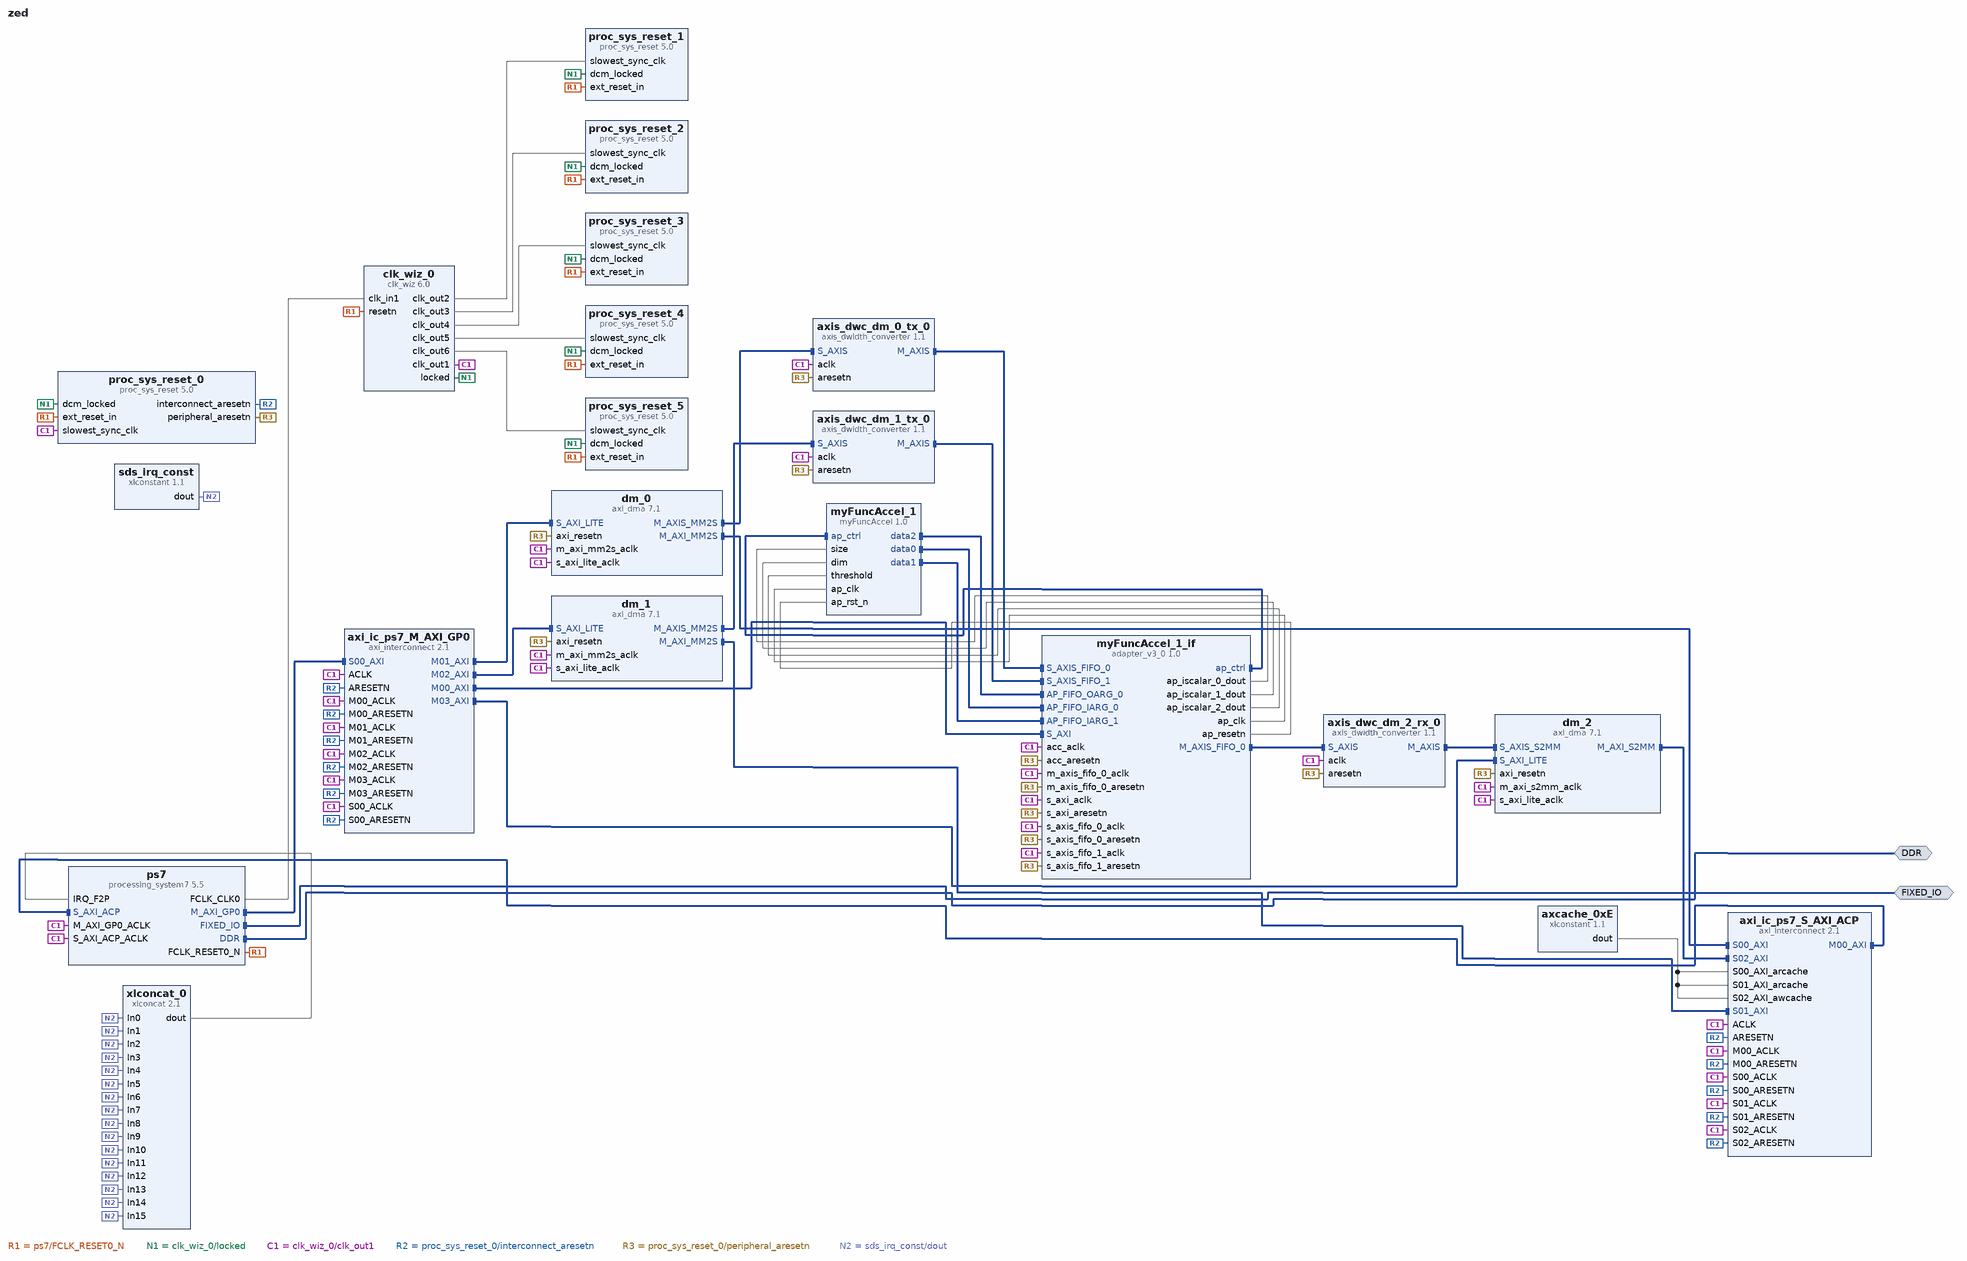
[diagram p0: block diagram of the top level]
# Vivado block design zed, xc7z020clg484-1, Vivado 2018.3
create_bd_design zed

create_bd_intf_port -mode Master -vlnv xilinx.com:interface:ddrx_rtl:1.0 DDR
create_bd_intf_port -mode Master -vlnv xilinx.com:display_processing_system7:fixedio_rtl:1.0 FIXED_IO

create_bd_cell -type ip -vlnv xilinx.com:ip:processing_system7:5.5 ps7
set_property -dict [list \
  CONFIG.PCW_APU_PERIPHERAL_FREQMHZ 666.666667 \
  CONFIG.PCW_ENET0_ENET0_IO {MIO 16 .. 27} \
  CONFIG.PCW_ENET0_GRP_MDIO_ENABLE 1 \
  CONFIG.PCW_ENET0_GRP_MDIO_IO {MIO 52 .. 53} \
  CONFIG.PCW_ENET0_PERIPHERAL_ENABLE 1 \
  CONFIG.PCW_ENET0_RESET_ENABLE 0 \
  CONFIG.PCW_ENET_RESET_ENABLE 1 \
  CONFIG.PCW_ENET_RESET_SELECT {Share reset pin} \
  CONFIG.PCW_FPGA0_PERIPHERAL_FREQMHZ 100.000000 \
  CONFIG.PCW_FPGA1_PERIPHERAL_FREQMHZ 150.000000 \
  CONFIG.PCW_GPIO_MIO_GPIO_ENABLE 1 \
  CONFIG.PCW_GPIO_MIO_GPIO_IO MIO \
  CONFIG.PCW_I2C_RESET_ENABLE 1 \
  CONFIG.PCW_IRQ_F2P_INTR 1 \
  CONFIG.PCW_PRESET_BANK1_VOLTAGE {LVCMOS 1.8V} \
  CONFIG.PCW_QSPI_GRP_SINGLE_SS_ENABLE 1 \
  CONFIG.PCW_QSPI_GRP_SINGLE_SS_IO {MIO 1 .. 6} \
  CONFIG.PCW_QSPI_PERIPHERAL_ENABLE 1 \
  CONFIG.PCW_QSPI_QSPI_IO {MIO 1 .. 6} \
  CONFIG.PCW_SD0_GRP_CD_ENABLE 1 \
  CONFIG.PCW_SD0_GRP_CD_IO {MIO 47} \
  CONFIG.PCW_SD0_GRP_WP_ENABLE 1 \
  CONFIG.PCW_SD0_GRP_WP_IO {MIO 46} \
  CONFIG.PCW_SD0_PERIPHERAL_ENABLE 1 \
  CONFIG.PCW_SD0_SD0_IO {MIO 40 .. 45} \
  CONFIG.PCW_SDIO_PERIPHERAL_FREQMHZ 50 \
  CONFIG.PCW_SINGLE_QSPI_DATA_MODE x4 \
  CONFIG.PCW_TTC0_PERIPHERAL_ENABLE 1 \
  CONFIG.PCW_TTC0_TTC0_IO EMIO \
  CONFIG.PCW_UART1_PERIPHERAL_ENABLE 1 \
  CONFIG.PCW_UART1_UART1_IO {MIO 48 .. 49} \
  CONFIG.PCW_UART_PERIPHERAL_FREQMHZ 50 \
  CONFIG.PCW_UIPARAM_DDR_FREQ_MHZ 533.333313 \
  CONFIG.PCW_UIPARAM_DDR_PARTNO {MT41J128M16 HA-15E} \
  CONFIG.PCW_USB0_PERIPHERAL_ENABLE 1 \
  CONFIG.PCW_USB0_RESET_ENABLE 0 \
  CONFIG.PCW_USB0_USB0_IO {MIO 28 .. 39} \
  CONFIG.PCW_USB_RESET_ENABLE 1 \
  CONFIG.PCW_USB_RESET_SELECT {Share reset pin} \
  CONFIG.PCW_USE_DEFAULT_ACP_USER_VAL 1 \
  CONFIG.PCW_USE_FABRIC_INTERRUPT 1 \
  CONFIG.PCW_USE_S_AXI_ACP 1 \
  CONFIG.preset ZedBoard \
] [get_bd_cells ps7]
# 224 more settings of ps7 are not shown: defaults, MIO pin electricals, DDR timing, and values the tool derives
create_bd_cell -type ip -vlnv xilinx.com:ip:xlconcat:2.1 xlconcat_0
set_property -dict {CONFIG.NUM_PORTS 16} [get_bd_cells xlconcat_0]
create_bd_cell -type ip -vlnv xilinx.com:ip:clk_wiz:6.0 clk_wiz_0
set_property -dict [list \
  CONFIG.CLKOUT1_REQUESTED_OUT_FREQ 100 \
  CONFIG.CLKOUT2_REQUESTED_OUT_FREQ 142 \
  CONFIG.CLKOUT2_USED true \
  CONFIG.CLKOUT3_REQUESTED_OUT_FREQ 166 \
  CONFIG.CLKOUT3_USED true \
  CONFIG.CLKOUT4_REQUESTED_OUT_FREQ 200 \
  CONFIG.CLKOUT4_USED true \
  CONFIG.CLKOUT5_REQUESTED_OUT_FREQ 50 \
  CONFIG.CLKOUT5_USED true \
  CONFIG.CLKOUT6_REQUESTED_OUT_FREQ 41.66 \
  CONFIG.CLKOUT6_USED true \
  CONFIG.RESET_TYPE ACTIVE_LOW \
] [get_bd_cells clk_wiz_0]
create_bd_cell -type ip -vlnv xilinx.com:ip:proc_sys_reset:5.0 proc_sys_reset_0
create_bd_cell -type ip -vlnv xilinx.com:ip:proc_sys_reset:5.0 proc_sys_reset_1
create_bd_cell -type ip -vlnv xilinx.com:ip:proc_sys_reset:5.0 proc_sys_reset_2
create_bd_cell -type ip -vlnv xilinx.com:ip:proc_sys_reset:5.0 proc_sys_reset_3
create_bd_cell -type ip -vlnv xilinx.com:ip:proc_sys_reset:5.0 proc_sys_reset_4
create_bd_cell -type ip -vlnv xilinx.com:ip:proc_sys_reset:5.0 proc_sys_reset_5
create_bd_cell -type ip -vlnv xilinx.com:ip:axi_dma:7.1 dm_0
set_property -dict [list \
  CONFIG.c_dlytmr_resolution 1250 \
  CONFIG.c_include_mm2s 1 \
  CONFIG.c_include_mm2s_dre 1 \
  CONFIG.c_include_mm2s_sf 1 \
  CONFIG.c_include_s2mm 0 \
  CONFIG.c_include_sg 0 \
  CONFIG.c_m_axi_mm2s_data_width 64 \
  CONFIG.c_m_axis_mm2s_tdata_width 64 \
  CONFIG.c_mm2s_burst_size 64 \
  CONFIG.c_sg_length_width 26 \
] [get_bd_cells dm_0]
create_bd_cell -type ip -vlnv xilinx.com:ip:axi_dma:7.1 dm_1
set_property -dict [list \
  CONFIG.c_dlytmr_resolution 1250 \
  CONFIG.c_include_mm2s 1 \
  CONFIG.c_include_mm2s_dre 1 \
  CONFIG.c_include_mm2s_sf 1 \
  CONFIG.c_include_s2mm 0 \
  CONFIG.c_include_sg 0 \
  CONFIG.c_m_axi_mm2s_data_width 64 \
  CONFIG.c_m_axis_mm2s_tdata_width 64 \
  CONFIG.c_mm2s_burst_size 64 \
  CONFIG.c_sg_length_width 26 \
] [get_bd_cells dm_1]
create_bd_cell -type ip -vlnv xilinx.com:ip:axi_dma:7.1 dm_2
set_property -dict [list \
  CONFIG.c_dlytmr_resolution 1250 \
  CONFIG.c_include_mm2s 0 \
  CONFIG.c_include_s2mm 1 \
  CONFIG.c_include_s2mm_dre 1 \
  CONFIG.c_include_s2mm_sf 1 \
  CONFIG.c_include_sg 0 \
  CONFIG.c_m_axi_s2mm_data_width 64 \
  CONFIG.c_s2mm_burst_size 64 \
  CONFIG.c_sg_length_width 26 \
] [get_bd_cells dm_2]
create_bd_cell -type ip -vlnv xilinx.com:hls:myFuncAccel:1.0 myFuncAccel_1
create_bd_cell -type ip -vlnv xilinx.com:ip:adapter_v3_0:1.0 myFuncAccel_1_if
set_property -dict [list \
  CONFIG.C_INPUT_SCALAR_0_WIDTH 32 \
  CONFIG.C_INPUT_SCALAR_1_WIDTH 32 \
  CONFIG.C_INPUT_SCALAR_2_WIDTH 32 \
  CONFIG.C_NUM_INPUT_FIFOs 2 \
  CONFIG.C_NUM_OUTPUT_FIFOs 1 \
  CONFIG.C_N_INPUT_SCALARS 3 \
  CONFIG.M_AXIS_FIFO_0_BYTE_WIDTH 32 \
  CONFIG.M_AXIS_FIFO_0_DEPTH 1024 \
  CONFIG.M_AXIS_FIFO_0_DMWIDTH 32 \
  CONFIG.M_AXIS_FIFO_0_WIDTH 32 \
  CONFIG.S_AXIS_FIFO_0_BYTE_WIDTH 32 \
  CONFIG.S_AXIS_FIFO_0_DEPTH 1024 \
  CONFIG.S_AXIS_FIFO_0_DMWIDTH 32 \
  CONFIG.S_AXIS_FIFO_0_WIDTH 32 \
  CONFIG.S_AXIS_FIFO_1_BYTE_WIDTH 32 \
  CONFIG.S_AXIS_FIFO_1_DEPTH 1024 \
  CONFIG.S_AXIS_FIFO_1_DMWIDTH 32 \
  CONFIG.S_AXIS_FIFO_1_WIDTH 32 \
] [get_bd_cells myFuncAccel_1_if]
create_bd_cell -type ip -vlnv xilinx.com:ip:axi_interconnect:2.1 axi_ic_ps7_M_AXI_GP0
set_property -dict [list \
  CONFIG.M00_HAS_REGSLICE 1 \
  CONFIG.M01_HAS_REGSLICE 1 \
  CONFIG.M02_HAS_REGSLICE 1 \
  CONFIG.M03_HAS_REGSLICE 1 \
  CONFIG.NUM_MI 4 \
  CONFIG.NUM_SI 1 \
  CONFIG.S00_HAS_REGSLICE 1 \
  CONFIG.STRATEGY 2 \
] [get_bd_cells axi_ic_ps7_M_AXI_GP0]
create_bd_cell -type ip -vlnv xilinx.com:ip:axi_interconnect:2.1 axi_ic_ps7_S_AXI_ACP
set_property -dict [list \
  CONFIG.M00_HAS_DATA_FIFO 2 \
  CONFIG.M00_HAS_REGSLICE 1 \
  CONFIG.NUM_MI 1 \
  CONFIG.NUM_SI 3 \
  CONFIG.S00_HAS_DATA_FIFO 2 \
  CONFIG.S00_HAS_REGSLICE 1 \
  CONFIG.S01_HAS_DATA_FIFO 2 \
  CONFIG.S01_HAS_REGSLICE 1 \
  CONFIG.S02_HAS_DATA_FIFO 2 \
  CONFIG.S02_HAS_REGSLICE 1 \
  CONFIG.STRATEGY 2 \
] [get_bd_cells axi_ic_ps7_S_AXI_ACP]
create_bd_cell -type ip -vlnv xilinx.com:ip:axis_dwidth_converter:1.1 axis_dwc_dm_0_tx_0
set_property -dict {CONFIG.M_TDATA_NUM_BYTES 4 CONFIG.S_TDATA_NUM_BYTES 8} [get_bd_cells axis_dwc_dm_0_tx_0]
create_bd_cell -type ip -vlnv xilinx.com:ip:axis_dwidth_converter:1.1 axis_dwc_dm_1_tx_0
set_property -dict {CONFIG.M_TDATA_NUM_BYTES 4 CONFIG.S_TDATA_NUM_BYTES 8} [get_bd_cells axis_dwc_dm_1_tx_0]
create_bd_cell -type ip -vlnv xilinx.com:ip:axis_dwidth_converter:1.1 axis_dwc_dm_2_rx_0
set_property -dict {CONFIG.M_TDATA_NUM_BYTES 8 CONFIG.S_TDATA_NUM_BYTES 4} [get_bd_cells axis_dwc_dm_2_rx_0]
create_bd_cell -type ip -vlnv xilinx.com:ip:xlconstant:1.1 sds_irq_const
set_property -dict {CONFIG.CONST_VAL 0 CONFIG.CONST_WIDTH 1} [get_bd_cells sds_irq_const]
create_bd_cell -type ip -vlnv xilinx.com:ip:xlconstant:1.1 axcache_0xE
set_property -dict {CONFIG.CONST_VAL 14 CONFIG.CONST_WIDTH 4} [get_bd_cells axcache_0xE]

# ---- connections ----

connect_bd_intf_net [get_bd_intf_pins dm_0/M_AXI_MM2S] [get_bd_intf_pins axi_ic_ps7_S_AXI_ACP/S00_AXI]
connect_bd_intf_net [get_bd_intf_ports FIXED_IO] [get_bd_intf_pins ps7/FIXED_IO]
connect_bd_intf_net [get_bd_intf_ports DDR] [get_bd_intf_pins ps7/DDR]
connect_bd_intf_net [get_bd_intf_pins dm_2/M_AXI_S2MM] [get_bd_intf_pins axi_ic_ps7_S_AXI_ACP/S02_AXI]
connect_bd_intf_net [get_bd_intf_pins myFuncAccel_1/data2] [get_bd_intf_pins myFuncAccel_1_if/AP_FIFO_OARG_0]
connect_bd_intf_net [get_bd_intf_pins myFuncAccel_1/data0] [get_bd_intf_pins myFuncAccel_1_if/AP_FIFO_IARG_0]
connect_bd_intf_net [get_bd_intf_pins ps7/M_AXI_GP0] [get_bd_intf_pins axi_ic_ps7_M_AXI_GP0/S00_AXI]
connect_bd_intf_net [get_bd_intf_pins myFuncAccel_1/data1] [get_bd_intf_pins myFuncAccel_1_if/AP_FIFO_IARG_1]
connect_bd_intf_net [get_bd_intf_pins myFuncAccel_1_if/ap_ctrl] [get_bd_intf_pins myFuncAccel_1/ap_ctrl]
connect_bd_intf_net [get_bd_intf_pins axi_ic_ps7_S_AXI_ACP/M00_AXI] [get_bd_intf_pins ps7/S_AXI_ACP]
connect_bd_intf_net [get_bd_intf_pins axi_ic_ps7_M_AXI_GP0/M00_AXI] [get_bd_intf_pins myFuncAccel_1_if/S_AXI]
connect_bd_intf_net [get_bd_intf_pins axi_ic_ps7_M_AXI_GP0/M03_AXI] [get_bd_intf_pins dm_2/S_AXI_LITE]
connect_bd_intf_net [get_bd_intf_pins axi_ic_ps7_M_AXI_GP0/M01_AXI] [get_bd_intf_pins dm_0/S_AXI_LITE]
connect_bd_intf_net [get_bd_intf_pins dm_0/M_AXIS_MM2S] [get_bd_intf_pins axis_dwc_dm_0_tx_0/S_AXIS]
connect_bd_intf_net [get_bd_intf_pins axis_dwc_dm_0_tx_0/M_AXIS] [get_bd_intf_pins myFuncAccel_1_if/S_AXIS_FIFO_0]
connect_bd_intf_net [get_bd_intf_pins dm_1/M_AXI_MM2S] [get_bd_intf_pins axi_ic_ps7_S_AXI_ACP/S01_AXI]
connect_bd_intf_net [get_bd_intf_pins axi_ic_ps7_M_AXI_GP0/M02_AXI] [get_bd_intf_pins dm_1/S_AXI_LITE]
connect_bd_intf_net [get_bd_intf_pins dm_1/M_AXIS_MM2S] [get_bd_intf_pins axis_dwc_dm_1_tx_0/S_AXIS]
connect_bd_intf_net [get_bd_intf_pins axis_dwc_dm_1_tx_0/M_AXIS] [get_bd_intf_pins myFuncAccel_1_if/S_AXIS_FIFO_1]
connect_bd_intf_net [get_bd_intf_pins myFuncAccel_1_if/M_AXIS_FIFO_0] [get_bd_intf_pins axis_dwc_dm_2_rx_0/S_AXIS]
connect_bd_intf_net [get_bd_intf_pins axis_dwc_dm_2_rx_0/M_AXIS] [get_bd_intf_pins dm_2/S_AXIS_S2MM]
connect_bd_net [get_bd_pins xlconcat_0/dout] [get_bd_pins ps7/IRQ_F2P]
connect_bd_net [get_bd_pins ps7/FCLK_RESET0_N] \
  [get_bd_pins clk_wiz_0/resetn] [get_bd_pins proc_sys_reset_0/ext_reset_in] [get_bd_pins proc_sys_reset_1/ext_reset_in] \
  [get_bd_pins proc_sys_reset_2/ext_reset_in] [get_bd_pins proc_sys_reset_3/ext_reset_in] \
  [get_bd_pins proc_sys_reset_4/ext_reset_in] [get_bd_pins proc_sys_reset_5/ext_reset_in]
connect_bd_net [get_bd_pins ps7/FCLK_CLK0] [get_bd_pins clk_wiz_0/clk_in1]
connect_bd_net [get_bd_pins clk_wiz_0/locked] \
  [get_bd_pins proc_sys_reset_0/dcm_locked] [get_bd_pins proc_sys_reset_1/dcm_locked] \
  [get_bd_pins proc_sys_reset_2/dcm_locked] [get_bd_pins proc_sys_reset_3/dcm_locked] \
  [get_bd_pins proc_sys_reset_4/dcm_locked] [get_bd_pins proc_sys_reset_5/dcm_locked]
connect_bd_net [get_bd_pins clk_wiz_0/clk_out1] \
  [get_bd_pins proc_sys_reset_0/slowest_sync_clk] [get_bd_pins ps7/M_AXI_GP0_ACLK] [get_bd_pins ps7/S_AXI_ACP_ACLK] \
  [get_bd_pins dm_0/s_axi_lite_aclk] [get_bd_pins dm_0/m_axi_mm2s_aclk] [get_bd_pins dm_1/s_axi_lite_aclk] \
  [get_bd_pins dm_1/m_axi_mm2s_aclk] [get_bd_pins dm_2/s_axi_lite_aclk] [get_bd_pins dm_2/m_axi_s2mm_aclk] \
  [get_bd_pins myFuncAccel_1_if/s_axi_aclk] [get_bd_pins myFuncAccel_1_if/s_axis_fifo_0_aclk] \
  [get_bd_pins myFuncAccel_1_if/s_axis_fifo_1_aclk] [get_bd_pins myFuncAccel_1_if/m_axis_fifo_0_aclk] \
  [get_bd_pins myFuncAccel_1_if/acc_aclk] [get_bd_pins axi_ic_ps7_M_AXI_GP0/S00_ACLK] \
  [get_bd_pins axi_ic_ps7_M_AXI_GP0/M00_ACLK] [get_bd_pins axi_ic_ps7_M_AXI_GP0/M01_ACLK] \
  [get_bd_pins axi_ic_ps7_M_AXI_GP0/M02_ACLK] [get_bd_pins axi_ic_ps7_M_AXI_GP0/M03_ACLK] \
  [get_bd_pins axi_ic_ps7_M_AXI_GP0/ACLK] [get_bd_pins axi_ic_ps7_S_AXI_ACP/S00_ACLK] \
  [get_bd_pins axi_ic_ps7_S_AXI_ACP/S01_ACLK] [get_bd_pins axi_ic_ps7_S_AXI_ACP/S02_ACLK] \
  [get_bd_pins axis_dwc_dm_0_tx_0/aclk] [get_bd_pins axis_dwc_dm_1_tx_0/aclk] [get_bd_pins axis_dwc_dm_2_rx_0/aclk] \
  [get_bd_pins axi_ic_ps7_S_AXI_ACP/ACLK] [get_bd_pins axi_ic_ps7_S_AXI_ACP/M00_ACLK]
connect_bd_net [get_bd_pins clk_wiz_0/clk_out2] [get_bd_pins proc_sys_reset_1/slowest_sync_clk]
connect_bd_net [get_bd_pins clk_wiz_0/clk_out3] [get_bd_pins proc_sys_reset_2/slowest_sync_clk]
connect_bd_net [get_bd_pins clk_wiz_0/clk_out4] [get_bd_pins proc_sys_reset_3/slowest_sync_clk]
connect_bd_net [get_bd_pins clk_wiz_0/clk_out5] [get_bd_pins proc_sys_reset_4/slowest_sync_clk]
connect_bd_net [get_bd_pins clk_wiz_0/clk_out6] [get_bd_pins proc_sys_reset_5/slowest_sync_clk]
connect_bd_net [get_bd_pins myFuncAccel_1_if/ap_iscalar_0_dout] [get_bd_pins myFuncAccel_1/size]
connect_bd_net [get_bd_pins myFuncAccel_1_if/ap_iscalar_1_dout] [get_bd_pins myFuncAccel_1/dim]
connect_bd_net [get_bd_pins myFuncAccel_1_if/ap_iscalar_2_dout] [get_bd_pins myFuncAccel_1/threshold]
connect_bd_net [get_bd_pins myFuncAccel_1_if/ap_clk] [get_bd_pins myFuncAccel_1/ap_clk]
connect_bd_net [get_bd_pins myFuncAccel_1_if/ap_resetn] [get_bd_pins myFuncAccel_1/ap_rst_n]
connect_bd_net [get_bd_pins proc_sys_reset_0/interconnect_aresetn] \
  [get_bd_pins axi_ic_ps7_M_AXI_GP0/S00_ARESETN] [get_bd_pins axi_ic_ps7_M_AXI_GP0/M00_ARESETN] \
  [get_bd_pins axi_ic_ps7_M_AXI_GP0/M01_ARESETN] [get_bd_pins axi_ic_ps7_M_AXI_GP0/M02_ARESETN] \
  [get_bd_pins axi_ic_ps7_M_AXI_GP0/M03_ARESETN] [get_bd_pins axi_ic_ps7_M_AXI_GP0/ARESETN] \
  [get_bd_pins axi_ic_ps7_S_AXI_ACP/M00_ARESETN] [get_bd_pins axi_ic_ps7_S_AXI_ACP/S00_ARESETN] \
  [get_bd_pins axi_ic_ps7_S_AXI_ACP/S01_ARESETN] [get_bd_pins axi_ic_ps7_S_AXI_ACP/S02_ARESETN] \
  [get_bd_pins axi_ic_ps7_S_AXI_ACP/ARESETN]
connect_bd_net [get_bd_pins proc_sys_reset_0/peripheral_aresetn] \
  [get_bd_pins dm_0/axi_resetn] [get_bd_pins dm_1/axi_resetn] [get_bd_pins dm_2/axi_resetn] \
  [get_bd_pins myFuncAccel_1_if/s_axi_aresetn] [get_bd_pins myFuncAccel_1_if/s_axis_fifo_0_aresetn] \
  [get_bd_pins myFuncAccel_1_if/s_axis_fifo_1_aresetn] [get_bd_pins myFuncAccel_1_if/m_axis_fifo_0_aresetn] \
  [get_bd_pins myFuncAccel_1_if/acc_aresetn] [get_bd_pins axis_dwc_dm_0_tx_0/aresetn] \
  [get_bd_pins axis_dwc_dm_1_tx_0/aresetn] [get_bd_pins axis_dwc_dm_2_rx_0/aresetn]
connect_bd_net [get_bd_pins sds_irq_const/dout] \
  [get_bd_pins xlconcat_0/In0] [get_bd_pins xlconcat_0/In1] [get_bd_pins xlconcat_0/In2] [get_bd_pins xlconcat_0/In3] \
  [get_bd_pins xlconcat_0/In4] [get_bd_pins xlconcat_0/In5] [get_bd_pins xlconcat_0/In6] [get_bd_pins xlconcat_0/In7] \
  [get_bd_pins xlconcat_0/In8] [get_bd_pins xlconcat_0/In9] [get_bd_pins xlconcat_0/In10] [get_bd_pins xlconcat_0/In11] \
  [get_bd_pins xlconcat_0/In12] [get_bd_pins xlconcat_0/In13] [get_bd_pins xlconcat_0/In14] [get_bd_pins xlconcat_0/In15]
connect_bd_net [get_bd_pins axcache_0xE/dout] \
  [get_bd_pins axi_ic_ps7_S_AXI_ACP/S00_AXI_arcache] [get_bd_pins axi_ic_ps7_S_AXI_ACP/S01_AXI_arcache] \
  [get_bd_pins axi_ic_ps7_S_AXI_ACP/S02_AXI_awcache]
set_property PFM.AXI_PORT {  M_AXI_GP0 {memport "M_AXI_GP" sptag "GP"}  M_AXI_GP1 {memport "M_AXI_GP" sptag "GP"}  S_AXI_ACP {memport "S_AXI_ACP" sptag "ACP" memory "ps7 ACP_DDR_LOWOCM"}  S_AXI_HP0 {memport "S_AXI_HP" sptag "HP" memory "ps7 HP0_DDR_LOWOCM"}  S_AXI_HP1 {memport "S_AXI_HP" sptag "HP" memory "ps7 HP1_DDR_LOWOCM"}  S_AXI_HP2 {memport "S_AXI_HP" sptag "HP" memory "ps7 HP2_DDR_LOWOCM"}  S_AXI_HP3 {memport "S_AXI_HP" sptag "HP" memory "ps7 HP3_DDR_LOWOCM"}  } [get_bd_cells ps7]
set_property PFM.IRQ {In0 {} In1 {} In2 {} In3 {} In4 {} In5 {} In6 {} In7 {} In8 {} In9 {} In10 {} In11 {} In12 {} In13 {} In14 {} In15 {}} [get_bd_cells xlconcat_0]
set_property PFM.CLOCK {  clk_out1 {id "2" is_default "true" proc_sys_reset "proc_sys_reset_0" }  clk_out2 {id "1" is_default "false" proc_sys_reset "proc_sys_reset_1" }  clk_out3 {id "0" is_default "false" proc_sys_reset "proc_sys_reset_2" }  clk_out4 {id "3" is_default "false" proc_sys_reset "proc_sys_reset_3" }  clk_out5 {id "4" is_default "false" proc_sys_reset "proc_sys_reset_4" }  clk_out6 {id "5" is_default "false" proc_sys_reset "proc_sys_reset_5" }  } [get_bd_cells clk_wiz_0]

# ---- address map ----
assign_bd_address -offset 0x00000000 -range 512M -target_address_space [get_bd_addr_spaces dm_0/Data_MM2S] [get_bd_addr_segs ps7/S_AXI_ACP/ACP_DDR_LOWOCM]
assign_bd_address -offset 0xFC000000 -range 16M -target_address_space [get_bd_addr_spaces dm_0/Data_MM2S] [get_bd_addr_segs ps7/S_AXI_ACP/ACP_QSPI_LINEAR]
exclude_bd_addr_seg -offset 0x40000000 -range 1G -target_address_space [get_bd_addr_spaces dm_0/Data_MM2S] [get_bd_addr_segs ps7/S_AXI_ACP/ACP_M_AXI_GP0]
exclude_bd_addr_seg -offset 0xE0000000 -range 4M -target_address_space [get_bd_addr_spaces dm_0/Data_MM2S] [get_bd_addr_segs ps7/S_AXI_ACP/ACP_IOP]
assign_bd_address -offset 0x00000000 -range 512M -target_address_space [get_bd_addr_spaces dm_1/Data_MM2S] [get_bd_addr_segs ps7/S_AXI_ACP/ACP_DDR_LOWOCM]
assign_bd_address -offset 0xFC000000 -range 16M -target_address_space [get_bd_addr_spaces dm_1/Data_MM2S] [get_bd_addr_segs ps7/S_AXI_ACP/ACP_QSPI_LINEAR]
exclude_bd_addr_seg -offset 0x40000000 -range 1G -target_address_space [get_bd_addr_spaces dm_1/Data_MM2S] [get_bd_addr_segs ps7/S_AXI_ACP/ACP_M_AXI_GP0]
exclude_bd_addr_seg -offset 0xE0000000 -range 4M -target_address_space [get_bd_addr_spaces dm_1/Data_MM2S] [get_bd_addr_segs ps7/S_AXI_ACP/ACP_IOP]
assign_bd_address -offset 0x00000000 -range 512M -target_address_space [get_bd_addr_spaces dm_2/Data_S2MM] [get_bd_addr_segs ps7/S_AXI_ACP/ACP_DDR_LOWOCM]
assign_bd_address -offset 0xFC000000 -range 16M -target_address_space [get_bd_addr_spaces dm_2/Data_S2MM] [get_bd_addr_segs ps7/S_AXI_ACP/ACP_QSPI_LINEAR]
exclude_bd_addr_seg -offset 0x40000000 -range 1G -target_address_space [get_bd_addr_spaces dm_2/Data_S2MM] [get_bd_addr_segs ps7/S_AXI_ACP/ACP_M_AXI_GP0]
exclude_bd_addr_seg -offset 0xE0000000 -range 4M -target_address_space [get_bd_addr_spaces dm_2/Data_S2MM] [get_bd_addr_segs ps7/S_AXI_ACP/ACP_IOP]
assign_bd_address -offset 0x40400000 -range 64K -target_address_space [get_bd_addr_spaces ps7/Data] [get_bd_addr_segs dm_0/S_AXI_LITE/Reg]
assign_bd_address -offset 0x40410000 -range 64K -target_address_space [get_bd_addr_spaces ps7/Data] [get_bd_addr_segs dm_1/S_AXI_LITE/Reg]
assign_bd_address -offset 0x40420000 -range 64K -target_address_space [get_bd_addr_spaces ps7/Data] [get_bd_addr_segs dm_2/S_AXI_LITE/Reg]
assign_bd_address -offset 0x43C00000 -range 64K -target_address_space [get_bd_addr_spaces ps7/Data] [get_bd_addr_segs myFuncAccel_1_if/S_AXI/reg0]

validate_bd_design
save_bd_design
